# EAGLE board Power (EAGLE 8.5.2), part 1 of 2
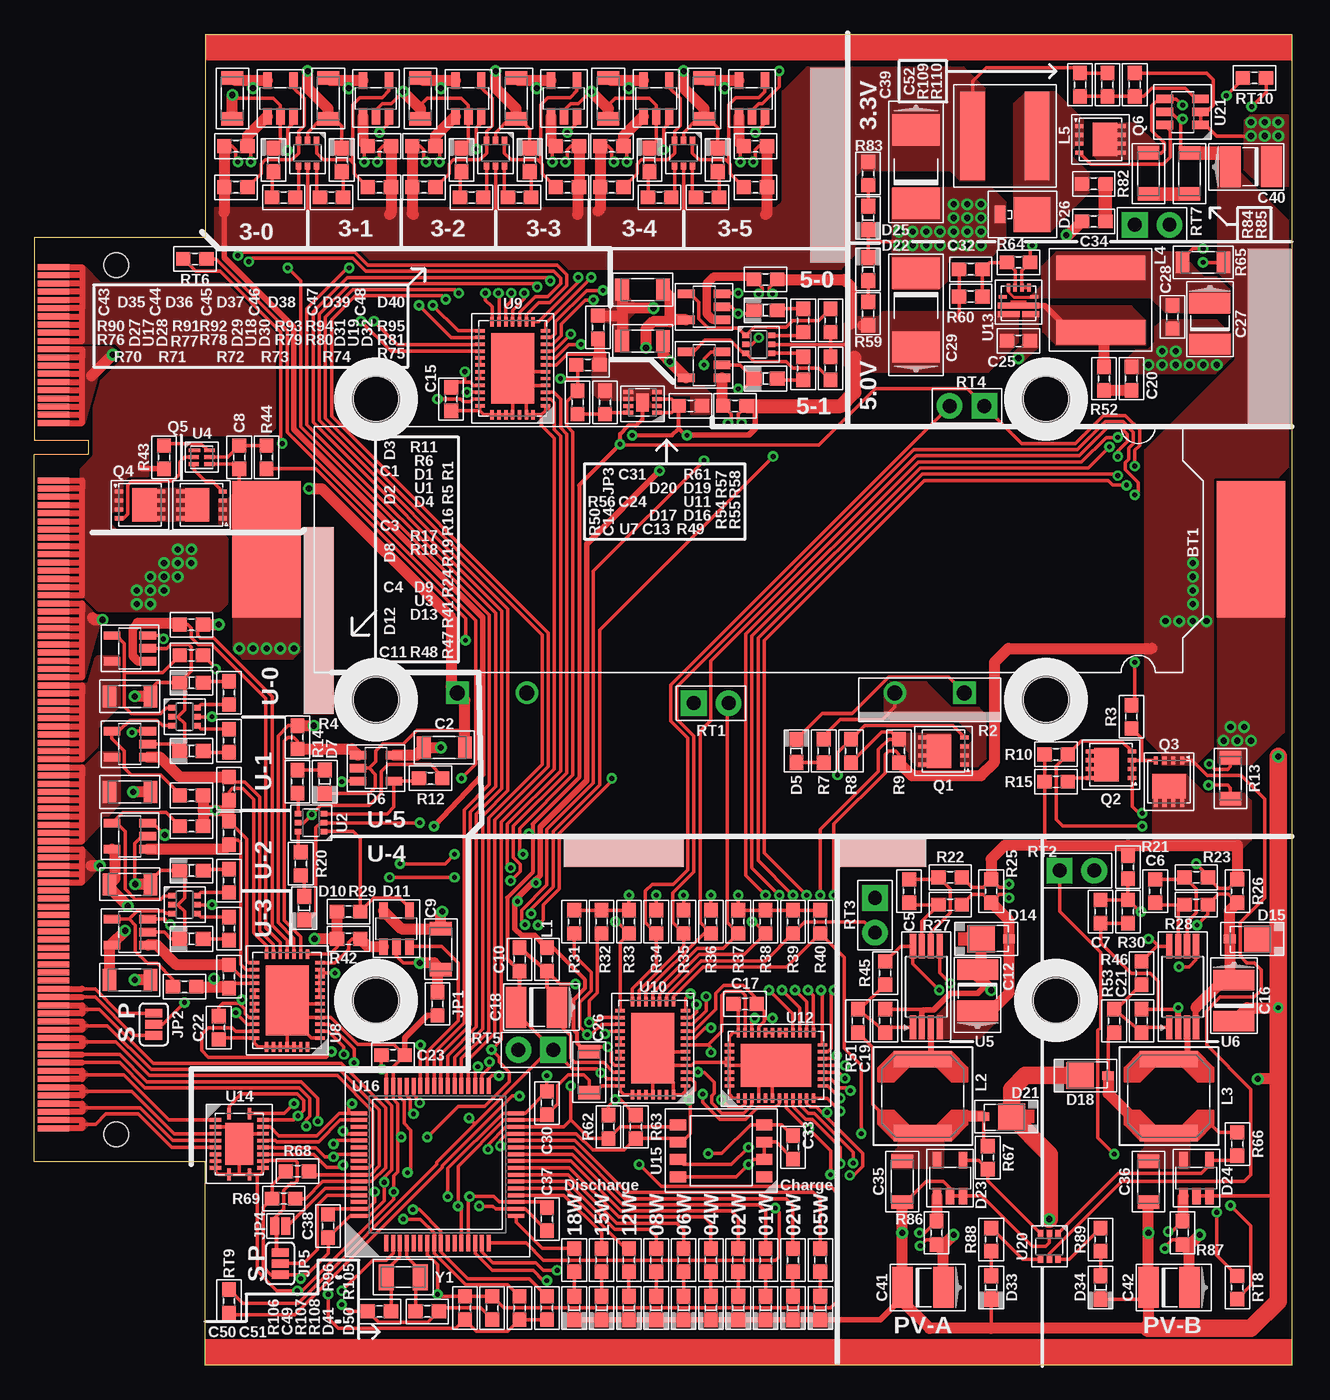
[diagram p4: board, top side]
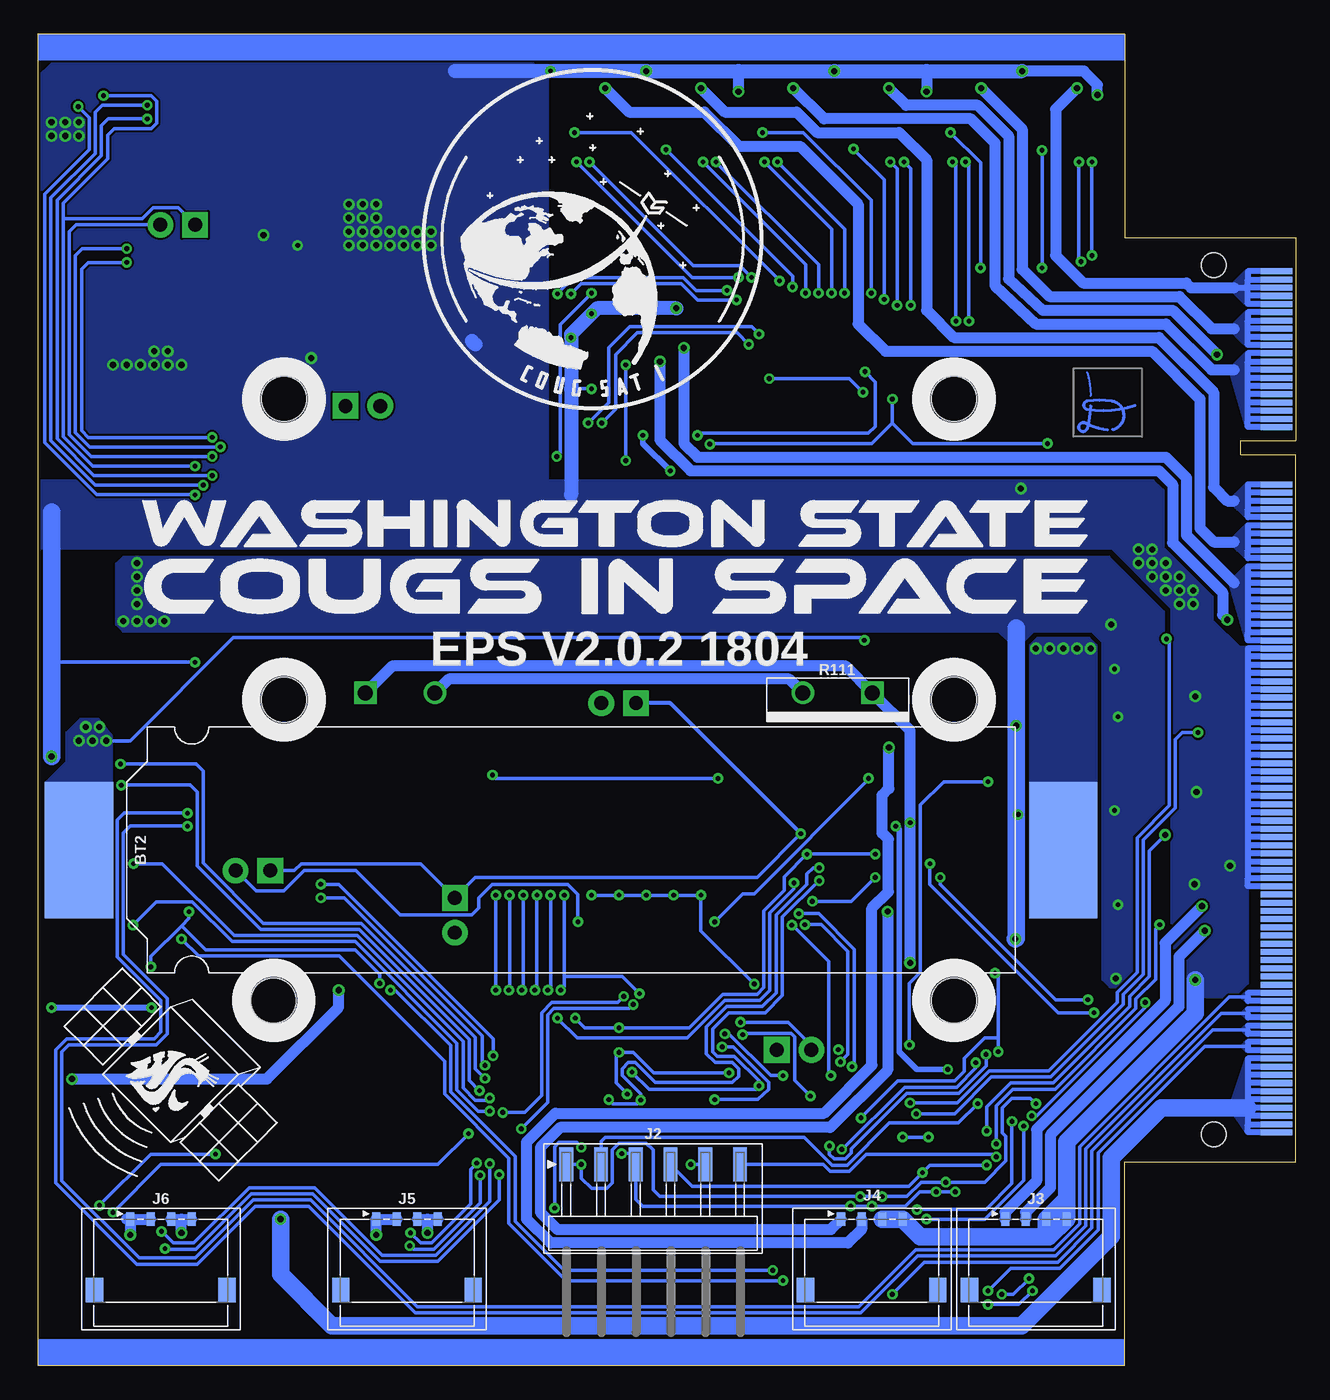
[diagram p5: board, bottom side, seen from below]

Size 92 x 97.4 mm. Coordinates in mm from the lower left corner, seen from the top.
Copper layers (1*16): Top 0.035mm / dielectric 0.9mm / Bottom 0.035mm
Design rules "JLCPCB *": minimum track width 6mil, minimum drill 0.3mm, track to track 6mil, track to pad 6mil, pad to pad 6mil, via to via 6mil, smd to smd 6mil, copper to edge 8mil, drill to drill 6mil, minimum pad ring 10mil, minimum via ring 8mil, stop-mask expansion 4mil, vias tented up to drill 20mil, thermal gap 10mil

## Footprints (pad centres in the part's own frame; a part is rotated, then mirrored left to right if it is on the bottom)
BAT-18650SOLDER = smd 5 x 10: A -36,0; C 36,0
3216 = smd 1 x 1.6: 1 -1.5,0; 2 1.5,0
1608 = smd 1.05 x 1: 1 -0.85,0; 2 0.85,0
4028-POL = smd 1.5 x 3: A 1.5,0; C -1.5,0
7132-POL = smd 2.3 x 3.5: A 2.7,0; C -2.7,0
1608-POL = smd 1.1 x 1: A 0.85,0; C -0.85,0
SOT23-5 = smd 0.62 x 1.22: 1 0.95,1.31; 2 0,1.31; 3 -0.95,1.31; 4 -0.95,-1.31; 5 0.95,-1.31
STMITE = smd 0.85 x 0.65: A -2.055,0 | smd 2 x 1.95: C 0,0
POWERMITE1 = smd 0.76 x 1.27: A 2.349,0 | smd 2.67 x 2.54: C 0,0
HOLE-3.3MM_PLAIN = hole 3.3: 0,0
COUGSATBUS_MALE-SODIMM = smd 2.3 x 0.44: 1 1.4,31.65; 3 1.4,31.05; 5 1.4,30.45; 7 1.4,29.85; 9 1.4,29.25; 11 1.4,28.65; 13 1.4,28.05; 15 1.4,27.45; 17 1.4,26.85; 19 1.4,26.25; 21 1.4,25.65; 23 1.4,25.05; 25 1.4,24.45; 27 1.4,23.85; 29 1.4,23.25; 31 1.4,22.65; 33 1.4,22.05; 35 1.4,21.45; 37 1.4,20.85; 39 1.4,20.25; 41 1.4,16.05; 43 1.4,15.45; 45 1.4,14.85; 47 1.4,14.25; 49 1.4,13.65; 51 1.4,13.05; 53 1.4,12.45; 55 1.4,11.85; 57 1.4,11.25; 59 1.4,10.65; 61 1.4,10.05; 63 1.4,9.45; 65 1.4,8.85; 67 1.4,8.25; 69 1.4,7.65; 71 1.4,7.05; 73 1.4,6.45; 75 1.4,5.85; 77 1.4,5.25; 79 1.4,4.65; 81 1.4,4.05; 83 1.4,3.45; 85 1.4,2.85; 87 1.4,2.25; 89 1.4,1.65; 91 1.4,1.05; 93 1.4,0.45; 95 1.4,-0.15; 97 1.4,-0.75; 99 1.4,-1.35; 101 1.4,-1.95; 103 1.4,-2.55; 105 1.4,-3.15; 107 1.4,-3.75; 109 1.4,-4.35; 111 1.4,-4.95; 113 1.4,-5.55; 115 1.4,-6.15; 117 1.4,-6.75; 119 1.4,-7.35; 121 1.4,-7.95; 123 1.4,-8.55; 125 1.4,-9.15; 127 1.4,-9.75; 129 1.4,-10.35; 131 1.4,-10.95; 133 1.4,-11.55; 135 1.4,-12.15; 137 1.4,-12.75; 139 1.4,-13.35; 141 1.4,-13.95; 143 1.4,-14.55; 145 1.4,-15.15; 147 1.4,-15.75; 149 1.4,-16.35; 151 1.4,-16.95; 153 1.4,-17.55; 155 1.4,-18.15; 157 1.4,-18.75; 159 1.4,-19.35; 161 1.4,-19.95; 163 1.4,-20.55; 165 1.4,-21.15; 167 1.4,-21.75; 169 1.4,-22.35; 171 1.4,-22.95; 173 1.4,-23.55; 175 1.4,-24.15; 177 1.4,-24.75; 179 1.4,-25.35; 181 1.4,-25.95; 183 1.4,-26.55; 185 1.4,-27.15; 187 1.4,-27.75; 189 1.4,-28.35; 191 1.4,-28.95; 193 1.4,-29.55; 195 1.4,-30.15; 197 1.4,-30.75; 199 1.4,-31.35 | smd 2.3 x 0.44 bottom: 2 1.4,31.35; 4 1.4,30.75; 6 1.4,30.15; 8 1.4,29.55; 10 1.4,28.95; 12 1.4,28.35; 14 1.4,27.75; 16 1.4,27.15; 18 1.4,26.55; 20 1.4,25.95; 22 1.4,25.35; 24 1.4,24.75; 26 1.4,24.15; 28 1.4,23.55; 30 1.4,22.95; 32 1.4,22.35; 34 1.4,21.75; 36 1.4,21.15; 38 1.4,20.55; 40 1.4,19.95; 42 1.4,15.75; 44 1.4,15.15; 46 1.4,14.55; 48 1.4,13.95; 50 1.4,13.35; 52 1.4,12.75; 54 1.4,12.15; 56 1.4,11.55; 58 1.4,10.95; 60 1.4,10.35; 62 1.4,9.75; 64 1.4,9.15; 66 1.4,8.55; 68 1.4,7.95; 70 1.4,7.35; 72 1.4,6.75; 74 1.4,6.15; 76 1.4,5.55; 78 1.4,4.95; 80 1.4,4.35; 82 1.4,3.75; 84 1.4,3.15; 86 1.4,2.55; 88 1.4,1.95; 90 1.4,1.35; 92 1.4,0.75; 94 1.4,0.15; 96 1.4,-0.45; 98 1.4,-1.05; 100 1.4,-1.65; 102 1.4,-2.25; 104 1.4,-2.85; 106 1.4,-3.45; 108 1.4,-4.05; 110 1.4,-4.65; 112 1.4,-5.25; 114 1.4,-5.85; 116 1.4,-6.45; 118 1.4,-7.05; 120 1.4,-7.65; 122 1.4,-8.25; 124 1.4,-8.85; 126 1.4,-9.45; 128 1.4,-10.05; 130 1.4,-10.65; 132 1.4,-11.25; 134 1.4,-11.85; 136 1.4,-12.45; 138 1.4,-13.05; 140 1.4,-13.65; 142 1.4,-14.25; 144 1.4,-14.85; 146 1.4,-15.45; 148 1.4,-16.05; 150 1.4,-16.65; 152 1.4,-17.25; 154 1.4,-17.85; 156 1.4,-18.45; 158 1.4,-19.05; 160 1.4,-19.65; 162 1.4,-20.25; 164 1.4,-20.85; 166 1.4,-21.45; 168 1.4,-22.05; 170 1.4,-22.65; 172 1.4,-23.25; 174 1.4,-23.85; 176 1.4,-24.45; 178 1.4,-25.05; 180 1.4,-25.65; 182 1.4,-26.25; 184 1.4,-26.85; 186 1.4,-27.45; 188 1.4,-28.05; 190 1.4,-28.65; 192 1.4,-29.25; 194 1.4,-29.85; 196 1.4,-30.45; 198 1.4,-31.05; 200 1.4,-31.65 | hole 1.8: 6,31.8; 6,-31.8
1X06_SMD-2.54MM-R = smd 1 x 2.5: 1 -6.35,0; 2 -3.81,0; 3 -1.27,0; 4 1.27,0; 5 3.81,0; 6 6.35,0
1X04_PICOLOCK1.5MM = smd 0.6 x 1: 1 2.25,0; 2 0.75,0; 3 -0.75,0; 4 -2.25,0 | smd 1.25 x 1.8: PAD@1 4.855,5.2; PAD@2 -4.833,5.2
SMT-JUMPER_3_NO_SILK = smd 0.635 x 1.27: 1 -0.813,0; 2 0,0; 3 0.813,0
SMT-JUMPER_2_NC_PASTE_SILK = smd 0.635 x 1.27: 1 -0.406,0; 2 0.406,0
INDUCTOR-LPS6235 = smd 1.2 x 4.25: 1 -2.7,0; 2 2.7,0
INDUCTOR-XAL7030 = smd 1.78 x 6.5: 2 2.36,0; 11 -2.36,0
SON-3.3X3.3MM = smd 0.6 x 0.3: 1 -1.55,0.975; 2 -1.55,0.325; 3 -1.55,-0.325; 4 -1.55,-0.975; 5 1.55,-0.975; 6 1.55,-0.325; 7 1.55,0.325; 8 1.55,0.975 | smd 1.775 x 2.45: PAD 0.325,0
TO220-2 = drill 1.1 square: 1 -2.54,0 | drill 1.1: 3 2.54,0
1X02_THERMISTOR = drill 1.016 pad 1.88 square: 1 0,0 | drill 1.016 pad 1.88: 2 2.54,0
SC70 = smd 0.4 x 0.5: 1 -0.65,-0.95; 2 0,-0.95; 3 0.65,-0.95; 4 0.65,0.95; 5 0,0.95; 6 -0.65,0.95
SON6-1.5X1.5MM = smd 0.28 x 0.85: 1 -0.5,-0.525 | smd 0.28 x 0.75: 2 0,-0.575; 3 0.5,-0.575; 4 0.5,0.575; 5 0,0.575; 6 -0.5,0.575
TSSOP8 = smd 0.45 x 1.78: 1 -0.975,-2.97; 2 -0.325,-2.97; 3 0.325,-2.97; 4 0.975,-2.97; 5 0.975,2.97; 6 0.325,2.97; 7 -0.325,2.97; 8 -0.975,2.97
WDFN8-2X2 = smd 0.7 x 0.29: 1 -1.05,0.75; 2 -1.05,0.25; 3 -1.05,-0.25; 4 -1.05,-0.75; 5 1.05,-0.75; 6 1.05,-0.25; 7 1.05,0.25; 8 1.05,0.75 | smd 0.9 x 1.3: PAD 0,0
QFN38-5X7 = smd 0.25 x 0.7: 1 -2.75,-2.4; 2 -2.25,-2.4; 3 -1.75,-2.4; 4 -1.25,-2.4; 5 -0.75,-2.4; 6 -0.25,-2.4; 7 0.25,-2.4; 8 0.75,-2.4; 9 1.25,-2.4; 10 1.75,-2.4; 11 2.25,-2.4; 12 2.75,-2.4; 20 2.75,2.4; 21 2.25,2.4; 22 1.75,2.4; 23 1.25,2.4; 24 0.75,2.4; 25 0.25,2.4; 26 -0.25,2.4; 27 -0.75,2.4; 28 -1.25,2.4; 29 -1.75,2.4; 30 -2.25,2.4; 31 -2.75,2.4 | smd 0.7 x 0.25: 13 3.4,-1.5; 14 3.4,-1; 15 3.4,-0.5; 16 3.4,0; 17 3.4,0.5; 18 3.4,1; 19 3.4,1.5; 32 -3.4,1.5; 33 -3.4,1; 34 -3.4,0.5; 35 -3.4,0; 36 -3.4,-0.5; 37 -3.4,-1; 38 -3.4,-1.5 | smd 5.15 x 3.15: PAD 0,0
QFN-TPS61236P = smd 1.25 x 0.44: 1 -0.9,0.77 | smd 3.05 x 0.45: 2 0,0.17 | smd 0.6 x 0.25: 3 -1.15,-0.475; 8 1.15,-0.475 | smd 0.25 x 0.6: 4 -0.75,-1.15; 5 -0.25,-1.15; 6 0.25,-1.15; 7 0.75,-1.15 | smd 1.6 x 0.44: 9 0.725,0.77
QFN20-3.5X4.5 = smd 0.85 x 0.28: 1 -2.225,-0.75; 10 2.225,-0.75; 11 2.225,0.75; 20 -2.225,0.75 | smd 0.28 x 0.85: 2 -1.75,-1.725; 3 -1.25,-1.725; 4 -0.75,-1.725; 5 -0.25,-1.725; 6 0.25,-1.725; 7 0.75,-1.725; 8 1.25,-1.725; 9 1.75,-1.725; 12 1.75,1.725; 13 1.25,1.725; 14 0.75,1.725; 15 0.25,1.725; 16 -0.25,1.725; 17 -0.75,1.725; 18 -1.25,1.725; 19 -1.75,1.725 | smd 3.05 x 2.05: PAD 0,0
SO8 = smd 1.2 x 0.8: 1 -3.15,1.905; 2 -3.15,0.635; 3 -3.15,-0.635; 4 -3.15,-1.905; 5 3.15,-1.905; 6 3.15,-0.635; 7 3.15,0.635; 8 3.15,1.905
QFP64-10X10 = smd 0.3 x 1.2: 1 -3.75,-5.75; 2 -3.25,-5.75; 3 -2.75,-5.75; 4 -2.25,-5.75; 5 -1.75,-5.75; 6 -1.25,-5.75; 7 -0.75,-5.75; 8 -0.25,-5.75; 9 0.25,-5.75; 10 0.75,-5.75; 11 1.25,-5.75; 12 1.75,-5.75; 13 2.25,-5.75; 14 2.75,-5.75; 15 3.25,-5.75; 16 3.75,-5.75; 33 3.75,5.75; 34 3.25,5.75; 35 2.75,5.75; 36 2.25,5.75; 37 1.75,5.75; 38 1.25,5.75; 39 0.75,5.75; 40 0.25,5.75; 41 -0.25,5.75; 42 -0.75,5.75; 43 -1.25,5.75; 44 -1.75,5.75; 45 -2.25,5.75; 46 -2.75,5.75; 47 -3.25,5.75; 48 -3.75,5.75 | smd 1.2 x 0.3: 17 5.75,-3.75; 18 5.75,-3.25; 19 5.75,-2.75; 20 5.75,-2.25; 21 5.75,-1.75; 22 5.75,-1.25; 23 5.75,-0.75; 24 5.75,-0.25; 25 5.75,0.25; 26 5.75,0.75; 27 5.75,1.25; 28 5.75,1.75; 29 5.75,2.25; 30 5.75,2.75; 31 5.75,3.25; 32 5.75,3.75; 49 -5.75,3.75; 50 -5.75,3.25; 51 -5.75,2.75; 52 -5.75,2.25; 53 -5.75,1.75; 54 -5.75,1.25; 55 -5.75,0.75; 56 -5.75,0.25; 57 -5.75,-0.25; 58 -5.75,-0.75; 59 -5.75,-1.25; 60 -5.75,-1.75; 61 -5.75,-2.25; 62 -5.75,-2.75; 63 -5.75,-3.25; 64 -5.75,-3.75
SOT23-6 = smd 0.62 x 1.22: 1 0.95,1.31; 2 0,1.31; 3 -0.95,1.31; 4 -0.95,-1.31; 5 0,-1.31; 6 0.95,-1.31
CRYSTAL-3.2X1.5 = smd 1.1 x 1.9: 1 -1.25,0; 2 1.25,0

## Placement (x,y rotation side)
BT1  18650  [BAT-18650SOLDER]  53,59.7 0 top
BT2  18650  [BAT-18650SOLDER]  53,37.7 180 bottom
C1  4.7µF  [3216]  7,48.95 0 top
C2  4.7µF  [3216]  30,45.2 0 top
C3  4.7µF  [3216]  7,41.95 0 top
C4  4.7µF  [3216]  7,35.2 0 top
C5  1µF  [1608]  64,34.7 90 top
C6  1µF  [1608]  82,34.7 90 top
C7  1nF  [1608]  78,33.2 270 top
C8  100nF  [1608]  15,66.45 270 top
C9  4.7µF  [3216]  29.75,30.45 270 top
C10  100nF  [1608]  35.5,29.7 270 top
C11  4.7µF  [3216]  7,28.2 0 top
C12  10µF  [4028-POL]  69,27.45 270 top
C13  100nF  [1608]  48,70.2 0 top
C14  270pF  [1608]  41.75,70.45 90 top
C15  100nF  [1608]  30.5,70.7 270 top
C16  10µF  [4028-POL]  87.75,26.7 90 top
C17  100nF  [1608]  52,26.45 180 top
C18  4.7µF  [4028-POL]  36.75,26.2 0 top
C19  100nF  [1608]  62.25,25.2 90 top
C20  470pF  [1608]  80.25,72.2 90 top
C21  100nF  [1608]  81,25.2 90 top
C22  100nF  [1608]  13.5,24.7 270 top
C23  100nF  [1608]  26.25,22.7 0 top
C24  4.7µF  [3216]  44.5,74.95 180 top
C25  1µF  [1608]  72,74.95 0 top
C26  100nF  [3216]  40.6,21.45 270 top
C27  10µF  [4028-POL]  86,76.2 90 top
C28  1µF  [1608]  83.25,76.7 270 top
C29  220µF  [7132-POL]  64.5,77.2 270 top
C30  100nF  [1608]  37.5,19.2 270 top
C31  4.7µF  [3216]  44.5,78.7 180 top
C32  10pF  [1608]  68.5,80.2 0 top
C33  100nF  [1608]  55.5,15.95 270 top
C34  470pF  [1608]  77.5,83.7 180 top
C35  4.7µF  [3216]  63.5,13.45 270 top
C36  4.7µF  [3216]  81.5,13.45 270 top
C37  100nF  [1608]  37.5,10.7 270 top
C38  100nF  [1608]  21.5,10.2 90 top
C39  220µF  [7132-POL]  64.5,87.7 90 top
C40  10µF  [4028-POL]  89,87.7 180 top
C41  47µF  [4028-POL]  65,5.7 0 top
C42  47µF  [4028-POL]  83,5.7 0 top
C43  4.7µF  [3216]  14.5,92.7 270 top
C44  4.7µF  [3216]  21.5,92.7 270 top
C45  4.7µF  [3216]  28.25,92.7 270 top
C46  4.7µF  [3216]  35.25,92.7 270 top
C47  4.7µF  [3216]  42,92.7 270 top
C48  4.7µF  [3216]  49,92.7 270 top
C49  10nF  [1608]  33.5,4.2 270 top
C50  15pF  [1608]  25.25,3.95 180 top
C51  15pF  [1608]  28.75,3.95 0 top
C52  4.7pF  [1608]  76.5,93.7 270 top
D1  GRN  [1608-POL]  11.5,49.95 0 top
D2  LTC4411  [SOT23-5]  7,45.45 270 top
D3  LTC4411  [SOT23-5]  7,52.45 270 top
D4  GRN  [1608-POL]  11.5,44.95 0 top
D5  GRN  [1608-POL]  55.75,44.95 270 top
D6  LTC4411  [SOT23-5]  25,43.7 90 top
D7  GRN  [1608-POL]  21.25,42.7 90 top
D8  LTC4411  [SOT23-5]  7,38.7 270 top
D9  GRN  [1608-POL]  11.5,36.2 0 top
D10  GRN  [1608-POL]  19.75,33.45 90 top
D11  LTC4411  [SOT23-5]  26.5,31.95 180 top
D12  LTC4411  [SOT23-5]  7,31.7 270 top
D13  GRN  [1608-POL]  11.5,31.2 0 top
D14  SMM4F5.0A  [STMITE]  69.25,31.2 180 top
D15  SMM4F5.0A  [STMITE]  89.5,31.2 0 top
D16  GRN  [1608-POL]  53.5,72.2 0 top
D17  LTC4411  [SOT23-5]  49,73.2 270 top
D18  SMM4F5.0A  [STMITE]  76.5,21.2 180 top
D19  GRN  [1608-POL]  53.5,77.2 0 top
D20  LTC4411  [SOT23-5]  49,77.45 270 top
D21  SMM4F5.0A  [STMITE]  71.5,18.2 0 top
D22  GRN  [1608-POL]  61,80.2 270 top
D23  LTC4411  [SOT23-5]  67,13.7 180 top
D24  LTC4411  [SOT23-5]  85,13.7 180 top
D25  GRN  [1608-POL]  61,83.95 90 top
D26  MBRM120LT3  [POWERMITE1]  73,84.2 180 top
D27  GRN  [1608-POL]  17.5,88.2 270 top
D28  GRN  [1608-POL]  22.5,88.2 270 top
D29  GRN  [1608-POL]  31.25,88.2 270 top
D30  GRN  [1608-POL]  36.25,88.2 270 top
D31  GRN  [1608-POL]  45,88.2 270 top
D32  GRN  [1608-POL]  50,88.2 270 top
D33  GRN  [1608-POL]  70,5.7 90 top
D34  GRN  [1608-POL]  78,5.7 90 top
D35  LTC4411  [SOT23-5]  18,92.7 180 top
D36  LTC4411  [SOT23-5]  25,92.7 180 top
D37  LTC4411  [SOT23-5]  31.75,92.7 180 top
D38  LTC4411  [SOT23-5]  38.75,92.7 180 top
D39  LTC4411  [SOT23-5]  45.5,92.7 180 top
D40  LTC4411  [SOT23-5]  52.5,92.7 180 top
D41  RED  [1608-POL]  39.5,4.2 90 top
D42  YLW  [1608-POL]  41.5,4.2 90 top
D43  YLW  [1608-POL]  43.5,4.2 90 top
D44  GRN  [1608-POL]  45.5,4.2 90 top
D45  GRN  [1608-POL]  47.5,4.2 90 top
D46  GRN  [1608-POL]  49.5,4.2 90 top
D47  GRN  [1608-POL]  51.5,4.2 90 top
D48  GRN  [1608-POL]  53.5,4.2 90 top
D49  BLU  [1608-POL]  55.5,4.2 90 top
D50  BLU  [1608-POL]  57.5,4.2 90 top
H1  MOUNTING_HOLE_PLAIN3MMBOLT  [HOLE-3.3MM_PLAIN]  25,48.7 0 top
H2  MOUNTING_HOLE_PLAIN3MMBOLT  [HOLE-3.3MM_PLAIN]  74,48.7 0 top
H3  MOUNTING_HOLE_PLAIN3MMBOLT  [HOLE-3.3MM_PLAIN]  25,70.7 0 top
H4  MOUNTING_HOLE_PLAIN3MMBOLT  [HOLE-3.3MM_PLAIN]  25,26.7 0 top
H5  MOUNTING_HOLE_PLAIN3MMBOLT  [HOLE-3.3MM_PLAIN]  74,70.7 0 top
H6  MOUNTING_HOLE_PLAIN3MMBOLT  [HOLE-3.3MM_PLAIN]  74.75,26.7 0 top
IMG1  COUGSINSPACELOGOTEXT  [COUGSINSPACETEXT]  49.5,59.45 0 bottom
IMG2  Bradley Davis  [SIGNATURE-BRADLEY]  16.25,67.95 0 bottom
IMG3  COUGSINSPACELOGOSMALL  [COUGSINSPACELOGO_SMALL]  82.29,21.28 0 bottom
IMG4  COUGSINSPACELOGOMEDIUM  [COUGSINSPACELOGO_MEDIUM]  51.43,82.4 0 bottom
J1  COUGSATBUSCARD  [COUGSATBUS_MALE-SODIMM]  0,48.7 0 top
J2  SWD  [1X06_SMD-2.54MM-R]  47,14.7 0 bottom
J3  UNREG  [1X04_PICOLOCK1.5MM]  19,10.7 180 bottom
J4  UNREG  [1X04_PICOLOCK1.5MM]  31,10.7 180 bottom
J5  PV1  [1X04_PICOLOCK1.5MM]  65,10.7 180 bottom
J6  PV1  [1X04_PICOLOCK1.5MM]  83,10.7 180 bottom
JP1  [1608]  29.5,26.45 90 top
JP2  SelectPrimary  [SMT-JUMPER_3_NO_SILK]  8.75,24.95 270 top
JP3  [1608]  41.25,75.95 270 top
JP4  NC  [SMT-JUMPER_2_NC_PASTE_SILK]  18,10.2 0 top
JP5  SelectPrimary  [SMT-JUMPER_3_NO_SILK]  18,7.45 90 top
L1  BLM18HE152SN1  [1608]  37.5,29.7 90 top
L2  10µH  [INDUCTOR-LPS6235]  65,19.7 270 top
L3  10µH  [INDUCTOR-LPS6235]  83,19.7 270 top
L4  1µH  [INDUCTOR-XAL7030]  78,77.95 270 top
L5  4.7µH  [INDUCTOR-XAL7030]  71,89.95 180 top
Q1  CSD25402Q3A  [SON-3.3X3.3MM]  66.5,44.95 180 top
Q2  CSD25402Q3A  [SON-3.3X3.3MM]  78.75,43.95 180 top
Q3  CSD25402Q3A  [SON-3.3X3.3MM]  83,42.7 270 top
Q4  CSD16406Q3  [SON-3.3X3.3MM]  7.75,62.95 0 top
Q5  CSD16406Q3  [SON-3.3X3.3MM]  12.25,62.95 180 top
Q6  CSD25402Q3A  [SON-3.3X3.3MM]  78,89.7 0 top
R1  560Ω  [1608]  14.25,49.2 90 top
R2  15Ω 30W  [TO220-2]  65.5,49.2 180 top
R3  100kΩ  [1608]  80.25,47.45 270 top
R4  50mΩ  [1608]  19.25,45.95 270 top
R5  560Ω  [1608]  14.25,45.7 270 top
R6  100kΩ  [1608]  11.5,51.95 180 top
R7  560Ω  [1608]  57.75,44.95 90 top
R8  10kΩ  [1608]  59.75,44.95 270 top
R9  50mΩ  [1608]  63.25,44.95 90 top
R10  10kΩ  [1608]  74.75,44.7 180 top
R11  50mΩ  [1608]  11.5,54.2 180 top
R12  100kΩ  [1608]  29,42.95 180 top
R13  10mΩ  [3216]  87.5,42.95 90 top
R14  560Ω  [1608]  19.25,42.7 90 top
R15  10kΩ  [1608]  74.75,42.7 180 top
R16  50mΩ  [1608]  14.25,42.2 90 top
R17  100kΩ  [1608]  11.5,41.7 180 top
R18  100kΩ  [1608]  11.5,39.45 180 top
R19  50mΩ  [1608]  14.25,38.95 270 top
R20  560Ω  [1608]  19.5,36.7 270 top
R21  820kΩ  [1608]  80,36.45 90 top
R22  1kΩ  [1608]  67,35.7 0 top
R23  1kΩ  [1608]  85,35.7 0 top
R24  560Ω  [1608]  14.25,35.45 90 top
R25  100mΩ  [1608]  70,34.7 90 top
R26  100mΩ  [1608]  88,34.7 90 top
R27  1kΩ  [1608]  67,33.7 0 top
R28  1kΩ  [1608]  85,33.7 0 top
R29  100kΩ  [1608]  23,33.2 0 top
R30  360kΩ  [1608]  80,33.2 90 top
R31  220kΩ  [1608]  39.5,32.45 90 top
R32  10kΩ  [1608]  41.5,32.45 90 top
R33  220kΩ  [1608]  43.5,32.45 90 top
R34  10kΩ  [1608]  45.5,32.45 90 top
R35  220kΩ  [1608]  47.5,32.45 90 top
R36  10kΩ  [1608]  49.5,32.45 90 top
R37  10kΩ  [1608]  51.5,32.45 90 top
R38  10kΩ  [1608]  53.5,32.45 90 top
R39  10kΩ  [1608]  55.5,32.45 90 top
R40  220kΩ  [1608]  57.5,32.45 90 top
R41  560Ω  [1608]  14.25,31.95 270 top
R42  50mΩ  [1608]  23,31.2 0 top
R43  2.2kΩ  [1608]  9.5,66.45 90 top
R44  330Ω  [1608]  17,66.45 270 top
R45  10kΩ  [1608]  62.25,28.7 90 top
R46  10kΩ  [1608]  81,28.7 90 top
R47  50mΩ  [1608]  14.25,28.45 90 top
R48  100kΩ  [1608]  11,27.7 180 top
R49  50mΩ  [1608]  51.25,70.2 180 top
R50  47kΩ  [1608]  39.75,70.45 90 top
R51  1kΩ  [1608]  60.25,25.2 90 top
R52  150Ω  [1608]  78.25,72.2 270 top
R53  1kΩ  [1608]  79,25.2 90 top
R54  1kΩ  [1608]  56.25,72.95 270 top
R55  100kΩ  [1608]  58.25,72.95 270 top
R56  12.1kΩ  [1608]  40.5,73.2 180 top
R57  1kΩ  [1608]  56.25,76.45 90 top
R58  100kΩ  [1608]  58.25,76.45 90 top
R59  1kΩ  [1608]  61,76.95 90 top
R60  1MΩ  [1608]  68.5,78.2 0 top
R61  50mΩ  [1608]  53.5,79.45 180 top
R62  1kΩ  [1608]  42,17.45 270 top
R63  1kΩ  [1608]  44,17.45 270 top
R64  330kΩ  [1608]  72,80.7 0 top
R65  10mΩ  [3216]  85.5,80.7 180 top
R66  100kΩ  [1608]  88,16.2 270 top
R67  100kΩ  [1608]  69.75,15.2 270 top
R68  1kΩ  [1608]  19.25,14.2 0 top
R69  1kΩ  [1608]  18.25,12.2 0 top
R70  560Ω  [1608]  18.25,85.45 180 top
R71  560Ω  [1608]  21.75,85.45 0 top
R72  560Ω  [1608]  32,85.45 180 top
R73  560Ω  [1608]  35.5,85.45 0 top
R74  560Ω  [1608]  45.75,85.45 180 top
R75  560Ω  [1608]  49.25,85.45 0 top
R76  100kΩ  [1608]  14.75,86.2 0 top
R77  100kΩ  [1608]  25.25,86.2 180 top
R78  100kΩ  [1608]  28.5,86.2 0 top
R79  100kΩ  [1608]  39,86.2 180 top
R80  100kΩ  [1608]  42.25,86.2 0 top
R81  100kΩ  [1608]  52.75,86.2 180 top
R82  150Ω  [1608]  77.5,86.45 0 top
R83  560Ω  [1608]  61,87.2 270 top
R84  10mΩ  [3216]  81.5,87.2 90 top
R85  10mΩ  [3216]  84.5,87.2 270 top
R86  50mΩ  [1608]  66,9.7 90 top
R87  50mΩ  [1608]  84,9.7 90 top
R88  560Ω  [1608]  70,9.2 270 top
R89  560Ω  [1608]  78,9.2 270 top
R90  50mΩ  [1608]  14.75,89.2 0 top
R91  50mΩ  [1608]  25.25,89.2 180 top
R92  50mΩ  [1608]  28.5,89.2 0 top
R93  50mΩ  [1608]  39,89.2 180 top
R94  50mΩ  [1608]  42.25,89.2 0 top
R95  50mΩ  [1608]  52.75,89.2 180 top
R96  560Ω  [1608]  39.5,7.7 270 top
R97  560Ω  [1608]  41.5,7.7 270 top
R98  560Ω  [1608]  43.5,7.7 270 top
R99  560Ω  [1608]  45.5,7.7 270 top
R100  560Ω  [1608]  47.5,7.7 270 top
R101  560Ω  [1608]  49.5,7.7 270 top
R102  560Ω  [1608]  51.5,7.7 270 top
R103  560Ω  [1608]  53.5,7.7 270 top
R104  560Ω  [1608]  55.5,7.7 270 top
R105  560Ω  [1608]  57.5,7.7 270 top
R106  100kΩ  [1608]  31.5,4.2 270 top
R107  1kΩ  [1608]  35.5,4.2 90 top
R108  1kΩ  [1608]  37.5,4.2 90 top
R109  620kΩ  [1608]  78.5,93.7 270 top
R110  360kΩ  [1608]  80.5,93.7 90 top
R111  15Ω 30W  [TO220-2]  33.5,49.2 180 bottom
RT1  NTCLE203E3302SB0  [1X02_THERMISTOR]  48.25,48.45 0 top
RT2  NTCLE203E3302SB0  [1X02_THERMISTOR]  75,36.2 0 top
RT3  NTCLE203E3302SB0  [1X02_THERMISTOR]  61.5,34.2 270 top
RT4  NTCLE203E3302SB0  [1X02_THERMISTOR]  69.5,70.2 180 top
RT5  NTCLE203E3302SB0  [1X02_THERMISTOR]  37.96,23.08 180 top
RT6  NTCS0603E3683JHT  [1608]  11.75,80.95 0 top
RT7  NTCLE203E3302SB0  [1X02_THERMISTOR]  80.5,83.45 0 top
RT8  NTCS0603E3683JHT  [1608]  88,5.7 90 top
RT9  NTCS0603E3683JHT  [1608]  14.25,4.7 270 top
RT10  NTCS0603E3683JHT  [1608]  89.25,94.2 0 top
U1  NC7WZ16  [SC70]  11,47.45 270 top
U2  NC7WZ16  [SC70]  20.25,39.7 90 top
U3  NC7WZ16  [SC70]  11,33.7 270 top
U4  BQ29700  [SON6-1.5X1.5MM]  12.25,66.45 270 top
U5  SPV1040  [TSSOP8]  65.25,27.7 0 top
U6  SPV1040  [TSSOP8]  84,27.7 0 top
U7  MCP1501-10  [WDFN8-2X2]  44.5,70.45 180 top
U8  LTC2499  [QFN38-5X7]  18.5,26.7 90 top
U9  LTC2499  [QFN38-5X7]  35,72.95 90 top
U10  LTC2499  [QFN38-5X7]  45.25,23.2 90 top
U11  NC7WZ16  [SC70]  53,74.7 270 top
U12  LTC2499  [QFN38-5X7]  54.25,21.95 0 top
U13  TPS61236P  [QFN-TPS61236P]  72,77.7 180 top
U14  74244  [QFN20-3.5X4.5]  15,16.2 270 top
U15  M24M01-R  [SO8]  50.25,15.7 180 top
U16  STM32L476RG  [QFP64-10X10]  29.5,14.7 0 top
U17  NC7WZ16  [SC70]  20,88.7 180 top
U18  NC7WZ16  [SC70]  33.75,88.7 180 top
U19  NC7WZ16  [SC70]  47.5,88.7 180 top
U20  NC7WZ16  [SC70]  74.25,8.7 180 top
U21  TPS64200  [SOT23-6]  84,91.7 270 top
Y1  ECS-.327-12.5-34QCS-TR  [CRYSTAL-3.2X1.5]  27,6.45 180 top

## Tracks (layer width: path | path; a pad name or v marks a point on that pad's centre or on a via)
3.3V  (via drill 0.35)
  Top 0.254: R109.1 C52.1 76.1,94.95 69.64,94.95 68.64,93.95 L5.2 | 53.5,89.3 R95.1 53,89.2 52.75,88.95 52.75,88.2 v52.6,88.05 | U19.5 47.5,83.95 | 39.75,89.3 R93.1 39.25,89.2 39,88.95 39,88.2 v38.85,88.05 | R94.1 42,89.2 42.25,88.95 42.25,88.2 v42.4,88.05 | U18.5 33.75,83.95 | R92.1 28.25,89.2 28.5,88.95 28.5,88.2 v28.65,88.05 | U17.5 20,83.95 | R91.1 25.5,89.2 25.25,88.95 25.25,88.2 v25.1,88.05 | R90.1 14.5,89.2 14.75,88.95 14.75,88.2 v14.9,88.05 | v14.9,81.2 15.15,81.45 23.45,81.45 24.4,80.5 38.25,80.5 38.95,79.8 38.95,79 37.7,77.75 36.9,77.75 36,76.85 U9.14 | v24.85,76.4 26.55,74.7 U9.22 | v28.15,77.55 30.5,75.2 U9.21 | v33.95,78.45 34,78.4 U9.18 | v34.9,78.45 34.9,77.85 34.5,77.45 U9.17 | U9.12 37.4,76.25 v40.75,79.6 | C37.1 37.1,11.95 U16.19 34,11.95 33.6,12.35 v31.85,12.35 31.75,12.25 U16.13 | v19,19.15 18.27,18.43 U14.20 | R68.1 17.4,13.2 R69.1 16.75,11.55 16.75,7.2 17.31,6.64 JP5.1 19.5,6.64 | 19.5,6.64 19.94,6.64 21.5,8.2 C38.1 23.1,10.95 U16.64 24.5,10.95 25.6,12.05 v25.6,13.4 25.6,13.75 26.15,14.3 26.15,19 25.75,19.4 U16.48 25.75,21.35 v25.45,21.65 25.4,21.7 C23.1 | R108.1 R107.1 34.65,2.5 32.35,2.5 R106.2 30.85,2.7 22.25,2.7 21.5,3.45 v21.5,5.2 | 19.5,6.64 v19.5,6.35 | v30.25,12.35 30.25,14.4 34.3,18.45 U16.32 35.9,18.45 C30.1 v37.5,21.2 | U15.8 51.34,13.8 v52.25,14.7 52.62,15.07 U15.2 U15.3 54.27,16.34 C33.2 | v41.75,24.25 41.95,24.45 U10.23
  Top 0.406: 13.9,84.35 13.9,81.05 19,75.95 19,68.5 32.8,54.7 32.8,43.25 v29.25,39.45
  Top 0.813: R94.1 R80.1 41.4,84.6 41.25,84.45 | R95.1 R81.1 53.6,84.3 53.5,84.2 | R93.1 R79.1 39.75,86.1 39.75,84.2 | R92.1 R78.1 27.65,84.3 27.75,84.2 | R90.1 R76.1 13.9,84.35 | R91.1 R77.1 26.1,84.3 26,84.2
  Bottom 0.254: v38.85,88.05 33.95,83.15 v33.95,78.45 | v52.6,88.05 44.15,79.6 v40.75,79.6 | v24.85,76.4 24.85,87.8 v25.1,88.05 | v28.15,77.55 28.15,87.55 v28.65,88.05 | v34.9,78.45 34.9,80.55 v42.4,88.05 | v14.9,81.2 v14.9,88.05 | v19.5,6.35 20.65,5.2 v21.5,5.2 | J2.1 v52.25,14.7 52.25,13.7 51.5,12.95 50.4,12.95 50,13.35 50,15.75 49.5,16.25 47.5,16.25 47,15.75 47,12.85 46.5,12.35 v31.85,12.35 v30.25,12.35 28.45,12.35 27.4,13.4 v25.6,13.4 22.75,13.4 21.2,14.95 21.2,16.75 21.45,17 21.45,18.85 20.75,19.55 19.4,19.55 v19,19.15 | v37.5,21.2 38.4,21.2 41.45,24.25 v41.75,24.25
  Bottom 0.406: v25.45,21.65 27.7,21.65 29,22.95 29,39.2 v29.25,39.45
  pour Top (no thermals): 13.25,84.65 54.25,84.65 54.75,85.15 54.75,93.2 56.5,94.95 68,94.95 69.5,93.45 69.5,86.7 67.75,86.7 67,87.45 60.5,87.45 60,86.95 60,81.25 59,80.25 39.1,80.25 38.4,80.95 24.55,80.95 23.6,81.9 13.25,81.9
3.3V_FB
  Top 0.254: C52.2 R109.2 R110.1 81.15,92.85 81.75,93.45 84.2,93.45 85,92.65 U21.3
3.3V_ISENSE  (via drill 0.35)
  Top 0.254: R84.2 82.45,88.7 82.65,88.9 82.65,89.45 81.75,90.35 81.75,92.15 82.25,92.65 U21.4 83.55,92.65 v84,92.2 | v79.9,64.4 78.9,64.4 78.55,64.75 65.1,64.75 53.4,53.05 53.4,37.5 v56.5,34.4 | v56.6,27.45 57,27.05 U12.20
  Bottom 0.254: v84,92.2 87.3,92.2 87.8,91.7 87.8,88.65 91.05,85.45 91.05,67.65 87.8,64.4 v79.9,64.4 | v56.5,34.4 56.5,27.55 v56.6,27.45
  pour Top (no thermals): 77.5,90.85 80.55,90.85 82.2,89.2 82.2,88.3 77.75,88.3 77.5,88.55
3.3V_LSW
  pour Top (no thermals): 72.55,93.15 74.7,93.15 76.7,91.15 76.7,89.3 76.2,89.3 75.9,89 75.9,88.45 77.1,87.25 77.1,85.8 74.3,83 71.7,83 71.7,92.3
3.3V_RISENSE
  Top 1: R85.2 R84.1
3.3V_SNUBBER
  Top 1: R82.2 C34.1
3.3V_SW
  Top 0.254: U21.6 83.1,90.34 83.1,88.4 82.6,87.9 77.28,87.9 Q6.4
5.0V_FB
  Top 0.254: R60.2 C32.2 69.85,80.7 R64.1 71.75,80.1 U13.6
5.0V_SNUBBER
  Top 0.813: R52.2 C20.1
5.0V_SW
  Top 0.406: U13.2 73.92,77.53 75.86,75.59 L4.2
  Top 0.813: R52.1 78.25,75.34 L4.2
  pour Top (no thermals): 73.8,77.45 80.25,77.45 81.25,76.45 81.25,74.7 74.75,74.7 73.8,75.65
5.0V_VIN  (via drill 0.35)
  Top 0.203: U13.7 71.25,78.56 71.63,78.18 U13.3
  Top 0.254: v85.5,81.7 84.75,81.7 84,80.95 R65.2 | v78.65,67.2 77.1,65.65 64.8,65.65 52.5,53.35 52.5,36.4 v54.5,34.4 | v54.7,27.45 56,26.15 U12.22
  Bottom 0.254: v85.5,81.7 88.75,81.7 89.25,81.2 89.25,68.25 88.2,67.2 v78.65,67.2 | v54.5,34.4 54.5,27.65 v54.7,27.45
  pour Top (no thermals): 72.95,78.15 81.65,78.15 82.75,77.05 87.4,77.05 87.4,78.7 86.5,79.6 85.6,79.6 83.8,81.4 74.75,81.4 73.75,80.4 73.75,79.05 72.95,78.25
5V  (via drill 0.35)
  Top 0.254: C32.1 R60.1 67.65,76.85 67.5,76.7 | 58.25,74.7 U11.5 | R55.1 58.25,74.7 | 58.25,74.7 R58.1 | R49.1 51.5,69.6 51.5,69.2 v51.75,68.95 | R61.1 53.75,78.85 53.75,78.65 v54,78.4 | 58.25,74.7 59.5,74.7 | U7.1 46.65,69.7 C13.1 46.65,70.7 U7.3 | U9.28 32.15,71.7 31.9,71.95 31.5,71.95 | 31.5,71.95 30.9,71.95 C15.1 | 31.5,71.95 v31.5,72.7 | U9.11 37.8,75.2 38.1,75.5 38.1,76.35 40.4,78.65 v41.6,78.65 | v39.25,75.45 38,74.2 U9.9 | U8.28 15.7,25.45 15.45,25.7 15.45,26.05 15,26.5 | C22.1 13.5,26.2 13.8,26.5 15,26.5 | v15.2,26.75 15.2,26.7 15,26.5 | U12.28 53,24.75 53.4,25.15 53.4,25.4 | 53.4,25.4 53.4,25.9 C17.1 52.85,26.8 51.85,27.8 50.45,27.8 49.85,27.2 49.85,26.05 48.25,24.45 U10.9 | U10.28 42.45,21.95 42.2,22.2 42.2,22.95 v41.95,23.3 40.95,23.3 C26.1 | v26,35.7 v30.75,35.7 | 53.4,25.4 v54,25.4 | R62.1 42,18.95 v42.5,19.45 42.85,19.45 R63.1
  Top 0.305: v43.75,68.05 46.65,68.05 47.15,68.55 | 47.15,68.55 C13.1 | 47.15,68.55 47.65,68.05 v47.75,68.05 | L1.2 37.95,30.55 40.3,28.2 40.3,27.6 39.45,26.75 39.45,24.55 39.7,24.3 39.7,23.6 40.35,22.95 C26.1
  Top 0.406: 52.75,70.2 52.75,68.55 52.25,68.05 v47.75,68.05 | v45.75,65.45 40.4,60.1 40.4,42.8 37,39.4 37,35.85 36.7,35.55 | L1.2 36.6,31.45 35.65,31.45 35.15,31.95 35.15,34 | v35.35,33.95 35.3,34 35.15,34 | 36.7,35.55 v36.7,35.3 | 36.7,35.55 35.15,34
  Top 0.813: 60.6,76.1 R59.1 | R61.1 59.25,79.45 59.75,78.95 59.75,76.2
  Top 1.016: R49.1 52.75,70.2 59,70.2 60,71.2 60,73.7
  Bottom 0.254: v31.5,72.7 30.75,71.95 30.75,68.7 31.25,68.2 43.6,68.2 v43.75,68.05 | v54,78.4 52.8,79.6 44.8,79.6 43.85,78.65 v41.6,78.65 | v51.75,68.95 50.25,70.45 50.25,74.45 48.7,76 39.8,76 v39.25,75.45 | v15.2,26.75 17.55,26.75 26,35.2 v26,35.7 | v35.35,33.95 32.5,33.95 v30.75,35.7 | v42.5,19.45 39.35,19.45 38.55,20.2 38.55,20.7 41.15,23.3 v41.95,23.3 | v36.7,35.3 36.7,34.85 38.45,33.1 38.45,27.45 39.2,26.7 41.75,26.7 44.5,23.95 52.55,23.95 v54,25.4
  Bottom 0.406: v47.75,68.05 47.75,67.45 v45.75,65.45
  pour Top (no thermals): 71.95,77.05 71.95,74.85 71.35,74.25 69.8,72.7 62.25,72.7 59.75,72.7 59.25,73.2 59.25,75.7 59.25,76.2 59.75,76.7 60.5,76.7 61.75,76.7 62,76.95 62.1,77.05
ADCA_ADCINN
  Top 0.254: U12.27 U12.26
ADCA_ADCINP
  Top 0.254: U12.24 U12.25
ADCB_ADCINN
  Top 0.254: U9.27 U9.26
ADCB_ADCINP
  Top 0.254: U9.25 U9.24
ADCC_ADCINN
  Top 0.254: U8.27 U8.26
ADCC_ADCINP
  Top 0.254: U8.25 U8.24
ADCF_ADCINN
  Top 0.254: U10.27 U10.26
ADCF_ADCINP
  Top 0.254: U10.25 U10.24
AGND  (via drill 0.35)
  Top 0.254: U9.30 32.1,70.7 31.9,70.5 31.4,70.5 31.2,70.7 v29.5,70.7 | U9.7 38.2,73.2 39,74 41.3,74 41.35,73.95 | v87.2,92.9 88.4,94.1 RT10.1 | RT6.1 11.8,80.05 13.6,80.05 18.05,75.6 18.05,67.55 v18.15,67.45 | U8.11 20.9,28.7 | 20.9,28.7 U8.10 U8.9 U8.8 U8.7 | U8.30 14.75,24.45 14.5,24.7 12.75,24.7 12.25,24.2 12.25,23.05 12.75,22.55 21.35,22.55 v21.75,22.95 | v22,28.7 20.9,28.7 | v42.85,67.4 42.9,67.35 57.4,67.35 61.5,71.45 68.25,71.45 RT4.1 72.25,67.45 76.15,67.45 78.2,69.5 79.8,69.5 80.85,68.45 80.85,67.3 80.5,66.95 v80.5,65.8 | RT5.1 37.68,23.08 32.27,17.68 | 32.27,17.68 29.45,14.85 29.45,14.7 19.3,4.55 15.25,4.55 RT9.1 | v31.8,18.1 32.23,17.68 32.27,17.68 | C18.C 35.25,25.79 RT5.1 | U12.7 54.5,19.15 54.25,18.9 52.95,18.9 52.05,18 50.15,18 48.9,19.25 v48.9,19.85 | 49.3,23.45 U10.7 | U12.30 52,27.05 51.7,27.35 50.6,27.35 50.3,27.05 50.3,24.45 49.3,23.45 | v49.5,22.9 49.5,23.25 49.3,23.45 | U10.30 41.9,20.95 v41.45,21.4 41.15,21.7 39.34,21.7 RT5.1 | RT2.1 75,33.2 78,30.2 78,24.7 77.8,24.5 77.8,16.65 v79,15.45 | RT8.1 89,5.85 89,10.2 v87.5,11.7
  Top 0.305: U7.PAD 44.5,69.25 44,68.75 43.45,68.75 42.85,68.15 v42.85,67.4 39.85,64.4 39.85,43 36.45,39.6 36.45,38.95 | 36.45,38.95 36.45,36.05 34.6,34.2 34.6,29.75 C10.2 35.5,26.45 C18.C | v36.2,38.9 36.4,38.9 36.45,38.95
  Top 0.813: 41.35,73.95 41.35,75 JP3.2
  Top 1: 41.35,73.95 R56.1
  Bottom 0.254: v29.5,70.7 29.5,68.95 | 29.5,68.95 31,67.45 42.8,67.45 v42.85,67.4 | v87.2,92.9 83.7,92.9 83.3,92.5 83.3,90.9 83.7,90.5 86.4,90.5 86.9,90 86.9,88.3 90.15,85.05 90.15,83.9 | RT7.1 81.75,84.7 83.55,84.7 84.35,83.9 90.15,83.9 | 90.15,83.9 90.15,67.95 88,65.8 v80.5,65.8 | v21.75,22.95 21.75,23.95 | 21.75,23.95 21.75,28.45 v22,28.7 | v18.15,67.45 28,67.45 29.5,68.95 | 21.75,23.95 22.75,23.95 24.25,22.45 24.25,21.5 24.95,20.8 29.1,20.8 v31.8,18.1 | v48.9,19.85 49.7,20.65 49.7,22.7 v49.5,22.9 48.45,22.9 46.95,21.4 v41.45,21.4 | RT2.1 73.25,36.2 72.75,36.7 64,36.7 RT3.1 60,35.7 39.4,35.7 v36.2,38.9 | v79,15.45 83.75,15.45 v87.5,11.7
  Bottom 0.305: v36.2,38.9 45.75,48.45 RT1.1
  pour Top (no thermals): 40.85,73.6 40.85,71.15 41.35,70.65 44.2,70.65 44.7,70.15 45.7,70.15 46.55,71 48.05,71 48.05,69.65 49.4,69.65 49.4,71.15 49,71.55 47.1,71.55 45.05,73.6
AVREF  (via drill 0.35)
  Top 0.254: U10.29 42.35,21.45 41.65,22.15 39.55,22.15 39.25,22.45 39.25,24.1 38.25,25.1 C18.A | L1.1 38.45,27.9 v39.6,27.9 | R40.2 R39.2 R38.2 R37.2 v51.5,34.4 | v49.5,34.4 R36.2 | v47.5,34.4 R35.2 | v45.5,34.4 R34.2 | v43.5,34.4 R33.2 R32.2 R31.2
  Top 0.305: C10.1 L1.1 37.5,27.7 38.25,26.95 C18.A
  Bottom 0.254: v51.5,34.4 v49.5,34.4 v47.5,34.4 v45.5,34.4 v43.5,34.4 43.5,31.8 v39.6,27.9
BATTPROTECT_BAT
  Top 0.254: U4.5 14.15,66.45 C8.1 R44.1
BATTPROTECT_COUT
  Top 0.254: Q4.4 6.53,61.98 6.85,62.3 6.85,64.4 7.15,64.7 10.15,64.7 10.65,65.2 10.65,66.1 11,66.45 U4.2
BATTPROTECT_SW
  pour Top (no thermals): 7.25,61.8 7.25,64.1 12.75,64.1 12.75,61.8
BATTPROTECT_V-
  Top 0.254: R43.2 9.65,67.45 12.2,67.45 12.7,66.95 U4.6
BATTPROTECT_VSS  (via drill 0.45)
  Top 0.254: U4.4 14.65,65.95 C8.2 15,64.2
  other vias: 15,52.45 16,52.45 17,52.45 18,52.45 19,52.45
  pour Bottom (no thermals): 19.4,32.8 14.6,32.8 14.6,52.7 15.1,53.2 18.9,53.2 19.4,52.7
  pour Top (no thermals): 14.6,64.6 14.6,52.35 15.25,51.7 18.9,51.7 19.4,52.2 19.4,64.6
  pour Top (no thermals): 13.55,63.35 14.15,63.35 14.75,63.95 15.75,63.95 15.75,60.95 14.75,60.95 14.1,61.6 13.55,61.6
BATTPROTECTDOUT
  Top 0.254: Q5.4 13.03,64.7 12.5,64.7 11.68,65.53 U4.3
BUS_I2C0_IRQ
  Top 0.254: 3.5,23.7 3.55,23.65 5.95,23.65 8.4,21.2 22.15,21.2 24.75,18.6 24.75,14.7 24.5,14.45 U16.57
  Top 0.44: J1.177 3.5,23.95 3.5,23.7 3.5,23.35 J1.179
  pour Top (no thermals): 3.5,23.95 3.8,23.65 3.5,23.35
BUS_I2C0_SCL
  Top 0.254: 3.5,24.95 3.6,24.85 5.35,24.85 8.55,21.65 22.3,21.65 25.25,18.7 25.25,14.6 24.6,13.95 U16.58 20.35,13.95 R68.2
  Top 0.44: J1.173 3.5,25.15 3.5,24.95 3.5,24.55 J1.175
  pour Top (no thermals): 3.5,25.15 3.8,24.85 3.5,24.55
BUS_I2C0_SDA
  Top 0.254: 3.5,26.2 3.65,26.05 4.75,26.05 8.7,22.1 22.45,22.1 25.7,18.85 25.7,14.45 24.7,13.45 U16.59 21.1,13.45 19.85,12.2 R69.2
  Top 0.44: J1.169 3.5,26.35 3.5,26.2 3.5,25.75 J1.171
  pour Top (no thermals): 3.5,26.35 3.8,26.05 3.5,25.75
BUS_JTAG_TCK
  Top 0.254: 3.5,21.3 3.55,21.25 6.55,21.25 9.85,17.95 U14.2
  Top 0.44: J1.185 3.5,21.55 3.5,21.3 3.5,20.95 J1.187
  pour Top (no thermals): 3.5,21.55 3.8,21.25 3.5,20.95
BUS_JTAG_TDI
  Top 0.254: 3.5,20.2 3.65,20.05 7.15,20.05 10.25,16.95 U14.4
  Top 0.44: J1.189 3.5,20.35 3.5,20.2 3.5,19.75 J1.191
  pour Top (no thermals): 3.5,20.35 3.8,20.05 3.5,19.75
BUS_JTAG_TDO
  Top 0.254: 3.5,18.95 3.6,18.85 7.75,18.85 10.15,16.45 U14.5
  Top 0.44: J1.193 3.5,19.15 3.5,18.95 3.5,18.55 J1.195
  pour Top (no thermals): 3.5,19.15 3.8,18.85 3.5,18.55
BUS_JTAG_TMS
  Top 0.254: 3.5,17.65 4.5,17.65 5.25,18.4 7.6,18.4 10.05,15.95 U14.6
  Top 0.44: J1.197 3.5,17.95 3.5,17.65 3.5,17.35 J1.199
  pour Top (no thermals): 3.5,17.95 3.8,17.65 3.5,17.35
CTRL_!RESET  (via drill 0.35)
  Top 0.254: U16.7 28.75,8.1 29.5,7.35 v29.5,5.2 29.65,5.05 R106.1 C49.1 34.35,4.2 58.25,4.2 58.75,4.7 58.75,12.6 58.25,13.1 45.85,13.1 v44.25,14.7
  Bottom 0.254: 3.5,24.45 3.6,24.55 6.05,24.55 14.9,15.7 14.9,10.05 17.4,7.55 27.15,7.55 v29.5,5.2 | v44.25,14.7 J2.5
  Bottom 0.44: J1.176 3.5,24.25 3.5,24.45 | J1.174 3.5,24.85
  pour Bottom (no thermals): 3.5,24.85 3.8,24.55 3.5,24.25
CTRL_SYNC  (via drill 0.35)
  Top 0.254: v22.5,5.45 24.75,7.7 25.75,7.7 26.25,8.2 U16.2
  Bottom 0.254: 3.5,23.45 3.6,23.35 6.65,23.35 14.45,15.55 14.45,9.9 17.25,7.1 20.85,7.1 v22.5,5.45
  Bottom 0.44: J1.180 3.5,23.05 3.5,23.45 | J1.178 3.5,23.65
  pour Bottom (no thermals): 3.5,23.65 3.8,23.35 3.5,23.05
DGND  (via drill 0.35)
  Top 0.254: 37.1,69.55 U9.38 U9.37 36,70.45 35,71.45 | 37.1,69.55 37.4,69.85 U9.1 37.6,70 | 32.6,69.85 U9.31 | 32.6,69.85 32.9,69.55 U9.32 U9.33 U9.34 U9.35 35,71.45 | 35,71.45 35,71.7 | 35,71.7 U9.PAD 35.25,72.7 U9.6 | U9.4 35,71.7 | C15.2 32.6,69.85 | U8.35 U8.34 U8.33 U8.32 16.4,23.3 16.1,23.6 U8.31 13.6,23.95 C22.2 | U8.35 18.5,25.2 | 18.5,25.2 U8.PAD 19,26.2 | 19,26.2 19.5,25.7 19.5,25.45 U8.4 21.7,25.45 23.65,23.5 26.3,23.5 C23.2 26.25,21.85 U16.47 26.25,19.5 26.6,19.15 26.6,16.7 | U8.6 19.25,26.45 19,26.2 | C38.2 21.9,11.45 U16.63 24.4,11.45 24.9,11.95 v24.9,12.7 | C37.2 35.9,11.45 U16.18 33.75,11.45 33.55,11.65 v32.55,11.65 | U14.7 U14.8 U14.9 13.28,14.18 13.47,13.98 U14.10 15,13.98 | U14.17 15.25,16.95 | 15.25,16.95 U14.PAD 15,13.98 | U14.3 15.25,17.45 15.25,16.95 | 15,13.98 U14.11 16.25,13.98 | 16.25,13.98 16.52,13.98 16.73,14.18 U14.12 U14.13 16.77,15 19.1,15 19.25,14.85 19.25,13.5 19.05,13.3 18.75,13.3 18.25,12.8 18.25,11.45 17.59,10.79 JP4.1 | 16.25,13.98 16.3,13.93 16.3,6.9 17.75,5.45 v19.25,5.45 19.6,5.45 26.3,12.15 v26.3,12.7 26.3,13.85 26.6,14.15 26.6,16.7 | C49.2 32.65,4.2 29.85,4.2 C51.2 28.8,3.15 25.2,3.15 C50.2 23,3.95 v22.5,4.45 | U16.12 31.25,11.4 v31,11.65 31,14.55 34.4,17.95 U16.31 37.35,17.95 C30.2 38.3,19.15 38.3,20.5 39.05,21.25 40.2,21.25 40.6,20.85 C26.2 41,19.95 41.5,20.45 U10.31 42.85,20.1 43.15,19.8 U10.32 U10.33 U10.34 U10.35 45.25,21.95 | U8.37 U8.36 U8.35 | U8.1 20.25,23.95 19,25.2 18.5,25.2 | 37.1,69.55 37.1,68.8 38.05,67.85 38.05,43.65 34.15,39.75 34.15,23.8 v33.45,23.1 34,22.55 34,22.2 34.75,21.45 34.75,20.75 32.95,18.95 31,18.95 v28.75,16.7
  Top 0.254: 26.6,16.7 v26.85,16.7 | C33.1 54.7,17.61 U15.4 52.41,17.61 50.3,15.5 v49.3,15.5 | U12.6 54,21.7 U12.PAD | U12.4 53,21.95 U12.PAD | U12.PAD U12.35 | 50.85,22.2 U12.34 U12.33 U12.32 50.85,24.05 51.15,24.35 U12.31 51.5,26.1 C17.2 | 50.85,22.2 U12.35 | U12.35 U12.36 U12.37 U12.38 50.85,19.85 51.15,19.55 U12.1 | U10.1 47.65,20.1 47.35,19.8 U10.38 46.75,20.7 45.5,21.95 | 45.25,21.95 45.25,22.95 | 45.25,22.95 U10.PAD | U10.6 45.25,22.95 | 45.5,21.95 U10.4 48.1,21.95 48.3,22.15 50.8,22.15 50.85,22.2 | 45.5,21.95 45.25,21.95
  Top 0.305: JP5.3 17.75,8.51 17.75,10.04 JP4.1
  Top 0.406: JP1.1 28.75,25.6 27.1,23.95 C23.2
  Bottom 0.254: v19.25,5.45 20.25,4.45 v22.5,4.45 | v24.9,12.7 v26.3,12.7 27.5,12.7 28.55,11.65 v31,11.65 v32.55,11.65 47.77,11.65 48.27,12.15 J2.3 48.27,15 48.77,15.5 v49.3,15.5 | v26.85,16.7 v28.75,16.7
I2C_SCL  (via drill 0.35)
  Top 0.254: U9.2 37.8,70.7 38.05,70.45 38.05,68.45 38.5,68 38.5,43.5 34.6,39.6 34.6,36.65 v34.85,36.4 | U8.2 21.5,24.45 22.65,23.3 v22.65,22.75 | v34.1,16.05 34.1,16.45 34.6,16.95 U16.29 39.65,16.95 40.85,15.75 43.15,15.75 R63.2 46.84,16.6 U15.6 47.38,16.34 48,16.95 48,19.3 v47.9,19.4 47.9,19.75 48.3,20.15 48.3,20.7 48.05,20.95 U10.2 | U12.2 52,19.15 51.75,18.9 50.8,18.9 v50.25,19.45
  Bottom 0.254: v22.65,22.75 22.65,21.9 24.65,19.9 28.45,19.9 32.5,15.85 32.5,15.55 32.95,15.1 33.75,15.1 34.1,15.45 v34.1,16.05 | 47.95,19.45 v47.9,19.4 | v47.9,19.4 48.15,19.15 49.95,19.15 v50.25,19.45 | v47.9,19.4 47.9,19.85 49.25,21.2 49.25,21.7 48.8,22.15 48.3,22.15 46.85,20.7 41.2,20.7 40.75,21.15 40.75,21.7 41.2,22.15 42.45,22.15 43.1,22.8 43.1,24.75 41.6,26.25 39,26.25 38,27.25 38,32.95 35.75,35.2 35.75,35.95 35.3,36.4 v34.85,36.4
I2C_SDA  (via drill 0.35)
  Top 0.254: U9.3 38,71.2 38.5,70.7 38.5,68.6 38.95,68.15 38.95,43.35 35.05,39.45 35.05,37.15 35.55,36.65 35.55,36.15 v34.85,35.45 | U8.3 21.6,24.95 23.4,23.15 v23.4,22.15 | v33.2,15.8 33.2,16.15 34.5,17.45 U16.30 38.75,17.45 39.25,17.95 | U12.3 52.5,19.05 51.9,18.45 50.3,18.45 49.55,19.2 49.55,19.7 49.75,19.9 49.75,20.7 49,21.45 v48.55,21.45 U10.3 | v39.25,20.45 39.25,17.95 | 39.25,17.95 40.6,16.6 R62.2 42.85,17.45 46.95,17.45 U15.5
  Bottom 0.254: v33.2,15.8 33.15,15.8 28.6,20.35 24.8,20.35 23.4,21.75 v23.4,22.15 | 39.5,20.3 v39.25,20.45 | v34.85,35.45 34.9,35.45 37.55,32.8 37.55,27.05 38.8,25.8 41.45,25.8 42.65,24.6 42.65,22.95 42.3,22.6 41.05,22.6 39.25,20.8 v39.25,20.45 | v39.25,20.45 39.5,20.2 47.3,20.2 v48.55,21.45
I3.3V_0  (via drill 0.35)
  Top 0.254: R90.2 15.85,88.95 v15.85,88.05 | v15.7,80.75 15.95,81 23.3,81 24.25,80.05 38,80.05 38.5,79.55 38.5,79.15 37.55,78.2 36.65,78.2 35.5,77.05 U9.15
  Top 0.813: D35.1 15.6,89.94 R90.2
  Bottom 0.254: v15.7,80.75 15.85,80.9 v15.85,88.05
I3.3V_1  (via drill 0.35)
  Top 0.254: R91.2 24.15,88.95 v24.15,88.05 | v23.9,76.4 26.1,74.2 U9.23
  Top 0.813: D36.1 24.05,89.55 R91.2
  Bottom 0.254: v23.9,76.4 23.9,87.8 v24.15,88.05
I3.3V_2  (via drill 0.35)
  Top 0.254: R92.2 29.65,88.9 v29.65,88.05 | v29.15,77.55 31,75.7 U9.20
  Top 0.813: D37.1 29.35,89.94 R92.2
  Bottom 0.254: v29.15,77.55 29.15,87.55 v29.65,88.05
I3.3V_3  (via drill 0.35)
  Top 0.254: R93.2 37.9,88.95 v37.9,88.05 | v33,78.45 33,77.95 33.5,77.45 U9.19
  Top 0.813: D38.1 37.8,89.55 R93.2
  Bottom 0.254: v37.9,88.05 33,83.15 v33,78.45
I3.3V_4  (via drill 0.35)
  Top 0.254: R94.2 43.35,88.95 v43.35,88.05 | v35.85,78.45 35.85,78.05 35,77.2 U9.16
  Top 0.813: D39.1 43.1,89.94 R94.2
  Bottom 0.254: v35.85,78.45 35.85,80.55 v43.35,88.05
I3.3V_5  (via drill 0.35)
  Top 0.254: R95.2 51.65,88.95 v51.65,88.05 | U9.13 36.9,76.35 39.8,79.25 v39.8,79.6
  Top 0.813: D40.1 51.55,89.55 R95.2
  Bottom 0.254: v51.65,88.05 44.05,80.45 40.65,80.45 v39.8,79.6
I5.0V_0  (via drill 0.35)
  Top 0.254: R61.2 53.25,78.85 53.25,78.65 v53,78.4 | U9.10 37.9,74.7 38.55,75.35 38.55,76.2 40.3,77.95 v40.9,77.95
  Top 0.61: D20.1 49.65,76.5 49.2,76.95 49.2,79.15 49.7,79.65 52.45,79.65 R61.2
  Bottom 0.254: v53,78.4 52.25,79.15 44.95,79.15 43.75,77.95 v40.9,77.95
I5.0V_1  (via drill 0.35)
  Top 0.254: R49.2 51,69.6 51,69.2 v50.75,68.95 | v40,74.7 39.1,74.7 38.1,73.7 U9.8
  Top 0.813: R49.2 50.31,70.29 D17.1
  Bottom 0.254: v50.75,68.95 49.75,69.95 49.75,73.95 48.15,75.55 40.85,75.55 v40,74.7
IBATT-  (via drill 0.35, 0.45)
  Top 0.254: R13.2 87.5,43.8 87.3,43.6 86.35,43.6 v85.95,44 | v31.55,53.05 31.55,54.65 20.6,65.6 R44.2 | U12.15 58.85,21.45 v59.3,21
  Bottom 0.254: v31.55,53.05 31.75,53.25 77.7,53.25 85.25,45.7 v87,45.7 | v59.3,21 60,21.7 60,24 68.35,32.35 75.5,32.35 79.9,36.75 79.9,43.5 80.4,44 v85.95,44
  other vias: 88,45.7 87.5,46.7 88.5,46.7 89,45.7
  pour Top (no thermals): 86.6,64.6 91.4,64.6 91.4,46.35 89.05,44 86.7,44 86.6,44.1
  pour Bottom (no thermals): 91.4,32.8 91.4,42.7 89.9,44.2 89.9,46.3 88.9,47.3 87.6,47.3 86.6,46.05 86.6,32.8
IHEATER  (via drill 0.35)
  Top 0.254: R8.2 62,46.35 62.7,46.35 R9.2 62.5,45.8 61.75,45.05 61.75,43.45 57.5,39.2 v57.5,34.4 | v57.55,27.45 57.65,27.35 U12.19
  Bottom 0.254: v57.5,34.4 57.5,27.5 v57.55,27.45
  pour Top (no thermals): 62.85,45.4 62.85,46.2 67,46.2 67,43.75 64.7,43.75 64.05,44.4 64.05,44.8 63.45,45.4
IUNREG_0
  Top 0.254: R11.2 11.25,54.2 11.5,53.95 11.5,53.25 12,52.75 13,52.75 16.95,48.8 16.95,32 18,30.95 U8.17
  Top 0.61: D3.1 7.6,51.5 7.2,51.9 7.2,53.9 7.6,54.3
  Top 0.813: 7.6,54.3 10.55,54.3 R11.2
IUNREG_1
  Top 0.254: R16.2 14.6,42.7 15.4,42.7 16.5,41.6 16.5,31.8 17.5,30.8 U8.18
  Top 0.813: D2.1 9.2,44.5 10.65,43.05 R16.2
IUNREG_2
  Top 0.254: R19.2 14.6,38.45 14.9,38.45 15.1,38.25 15.1,29.35 15.5,28.95 U8.21
  Top 0.813: R19.2 13.9,37.75 D8.1
IUNREG_3
  Top 0.254: R47.2 15.1,28.45 U8.22
  Top 0.813: D12.1 8.95,30.75 10.4,29.3 R47.2
IUNREG_4
  Top 0.254: R42.2 23.25,31.2 23,30.95 23,30.45 22,29.45 U8.12
  Top 0.813: R42.2 24.41,30.64 D11.1
IUNREG_5
  Top 0.254: R4.2 19.25,45.7 19,45.95 18.55,45.95 18.3,45.7 18.3,32.55 19.5,31.35 U8.14
  Top 0.813: 19.35,45.2 R4.2 23.24,45.1 D6.1
JTAG_SEL_PMIC  (via drill 0.35)
  Top 0.254: JP2.2 9.4,24.95 v11,26.55 | U14.1 14.25,18.95 15.15,19.85 19.25,19.85 19.7,19.4 19.7,18.65 v19.3,18.25 19,17.95 U14.19
  Bottom 0.254: v11,26.55 11,26.2 18.95,18.25 v19.3,18.25
JTAG_SEL_PMIC0
  Top 0.254: 3.5,27.55 4.45,27.55 6.24,25.76 JP2.1
  Top 0.44: J1.165 3.5,27.55
JTAG_SEL_PMIC1
  Top 0.254: 3.5,26.95 4.45,26.95 7.26,24.14 JP2.3
  Top 0.44: J1.167 3.5,26.95
JTAG_TCK  (via drill 0.35)
  Top 0.254: 23,18.45 22.3,18.45 20.65,16.8 17.9,16.8 17.25,17.45 U14.18 | 23,18.45 U16.49 | 23,18.45 23,18.9 v23.25,19.15
  Bottom 0.254: v23.25,19.15 24.68,17.73 29.73,17.73 32.8,14.65 33.9,14.65 35.95,16.7 50.5,16.7 50.81,16.39 J2.2
JTAG_TDI
  Top 0.254: U16.50 22.4,17.95 20.8,16.35 17.75,16.35 17.65,16.45 U14.16
JTAG_TDO  (via drill 0.35)
  Top 0.254: U16.55 22.05,15.45 v21.9,15.25 21.25,15.25 20.6,15.9 17.6,15.9 17.55,15.95 U14.15
  Bottom 0.254: 40.75,13.7 40.65,13.8 J2.6 34.55,14.7 34.05,14.2 32.65,14.2 31.4,15.45 22.05,15.45 v21.9,15.25
JTAG_TMS  (via drill 0.35)
  Top 0.254: U14.14 20.45,15.45 21.4,14.5 22.45,14.5 v22.6,14.65 | U16.46 26.75,19.6 27.05,19.3 27.05,17.7 27.55,17.2 27.55,14.35 v27.3,14.1
  Bottom 0.254: J2.4 44.13,13.1 28.3,13.1 v27.3,14.1 26.75,14.65 v22.6,14.65
MEM_!WC  (via drill 0.35)
  Top 0.254: U16.16 36,8.95 37.25,7.7 54.25,7.7 54.5,7.95 54.5,11.2 v54.2,11.5 | U15.7 47.47,14.7 51,14.7 v52.25,15.95
  Bottom 0.254: v52.25,15.95 52.6,16.3 53.9,16.3 54.2,16 v54.2,11.5
MPPTA_VIN
  Top 0.254: L2.2 63.45,17 61.35,19.1 61.35,23.25 R51.1 | R67.1 69.44,16.36 D21.A
  Top 0.813: D21.A 67.65,18.2 66.45,17 L2.2
  pour Top (no thermals): 62.75,15.45 63.25,15.95 63.25,17.45 66.5,17.45 66.5,14.45 62.75,14.45
MPPTB_VIN
  Top 0.254: R66.1 86.65,17.05 86,17.7 85.3,17 L3.2 | D18.A 78.56,23.91 R53.1
  Top 0.813: D18.A 78.56,19.9 81.45,17 L3.2
  pour Top (no thermals): 80.75,15.45 81.25,15.95 81.25,17.45 84.5,17.45 84.5,14.45 80.75,14.45
OSC32_IN
  Top 0.254: U16.3 26.75,7.95 25.75,6.95 Y1.2 26.1,6.1 C50.1
OSC32_OUT
  Top 0.254: U16.4 27.25,7.95 28.25,6.95 Y1.1 27.9,6.1 C51.1
PGND  (via drill 0.35, 0.45)
  Top 0.254: D33.C 70,2.7 | D24.2 D24.3 90.94,12.39 91,12.45 | 81.75,11.95 C36.2 | D34.C 81.35,4.85 81.5,4.7 | C21.2 82.23,26.05 | 82.23,26.05 83.56,26.05 v83.67,26.16 | 82.23,26.05 82.23,28.1 81.65,28.69 80.23,28.69 78,30.91 C7.2 R30.1 | C19.2 64.85,26.05 64.85,25.95 64.92,25.88 | C35.2 63.75,11.95 65.25,13.45 66.5,13.45 67,12.95 D23.2 D23.3 69.31,12.39 73,8.7 74,8.7 74.25,8.95 U20.2 | R110.2 85.75,94.55 86.25,94.05 86.25,92.2 85.75,91.7 U21.2 U21.1 85.7,90.75 86.5,89.95 v89,89.95 | U19.2 47.5,90.2 48.5,91.2 C48.2 49.35,91.2 50,90.55 D32.C 50.05,89.05 | D31.C 45.5,89.55 D39.2 45.5,92.2 45,92.7 42.5,92.7 42,92.2 42,91.95 | 52.5,91.85 D40.2 52.5,91.8 53,92.3 53.25,92.3 54.5,93.55 v54.5,94.7 | U18.2 33.75,90.2 34.75,91.2 C46.2 35.5,91.2 36.25,90.45 D30.C | D38.2 38.75,91.8 39.25,92.3 39.8,92.3 40.7,93.2 v40.75,93.2 | D29.C 31.75,89.55 D37.2 31.75,92.2 31.25,92.7 28.75,92.7 28.25,92.2 28.25,91.95 | D36.2 25,91.85 25.45,92.3 26.1,92.3 v27,93.2 | D27.C 18,89.55 D35.2 18,92.2 17.5,92.7 14.75,92.7 v14.5,92.95 | U17.2 20,90.2 21,91.2 C44.2 21.95,91.2 22.5,90.65 D28.C | D22.C 61,82.2 | 61,82.2 D25.C | 61,82.2 63,82.2 v63.25,81.95 | D17.2 51.65,73.2 D16.C 51.9,71.45 v51.5,71.45 | D19.C 52.4,76.95 v51.5,76.95 51,77.45 D20.2 | 89,90.75 v89,90.95 | U11.2 52.5,74.7 v53,75.2 | U13.4 U13.5 72.25,80.1 R64.2 72.85,81.8 v73,81.95 | D2.2 10.15,45.45 D4.C 11,45.3 11,46.95 10.5,47.45 | 8.5,48.45 C1.2 8.5,49.45 9,49.95 D1.C | U1.2 10.5,47.45 | 10.5,47.45 11,47.95 11,49.6 D1.C | D3.2 9.7,52.45 10,52.75 11.3,52.75 11.5,52.55 11.5,50.8 D1.C | C4.2 8.5,35.45 9.25,36.2 D9.C 11,35.85 11,34.2 10.5,33.7 | U3.2 10.5,33.7
  Top 0.254: 10.5,33.7 11,33.2 11,31.55 D13.C 10,31.2 9.5,31.7 D12.2 | D8.2 7.85,38.7 7.35,38.2 7.35,35.25 v7.4,35.2 | D7.C 24.5,41.85 24.95,42.3 24.95,43.25 24.5,43.7 | 24.5,43.7 D6.2 | D10.C 20.1,32.6 20.6,33.1 20.6,39.35 20.95,39.7 U2.2 v28.2,39.7 | D11.2 26.5,29.95 27,29.45 v28.2,29.45 | 24.5,43.7 25,44.2 25,44.95 25.5,45.45 27,45.45 28,46.45 31.5,46.45 | D5.C 57.65,47.7 59.85,47.7 62.5,50.35 66.89,50.35 R2.1 | R3.1 80.5,48.55 v80.5,51.45
  Top 0.406: R43.1 7.85,65.6 7.75,65.7 | D41.C D42.C D43.C D44.C D45.C D46.C D47.C D48.C D49.C D50.C 61.9,3.35 63.5,4.95 | 68,28.95 C12.C | U5.2 64.92,25.88 65.05,26 65.8,26 67,27.2 69,27.2 69.62,27.83
  Top 0.44: J1.1 3.5,80.35 3.5,79.75 | 3.5,79.75 J1.3 | 3.5,79.75 3.5,79.15 | 3.5,79.15 J1.5 | 3.5,79.15 3.5,78.55 | 3.5,78.55 J1.7 | 3.5,78.55 3.5,77.95 | 3.5,77.95 J1.9 | 3.5,77.95 3.5,77.35 | 3.5,77.35 J1.11 | J1.13 3.5,76.75 | 3.5,76.75 3.5,77.35 | J1.15 3.5,76.15 | 3.5,76.15 3.5,76.75 | J1.17 3.5,75.55 | 3.5,75.55 3.5,76.15 | J1.19 3.5,74.95 3.5,75.55 | J1.41 3.5,64.75 3.5,64.15 | 3.5,64.15 J1.43 | J1.45 3.5,63.55 | 3.5,63.55 3.5,64.15 | J1.47 3.5,62.95 | 3.5,62.95 3.5,63.55 | J1.49 3.5,62.35 | 3.5,62.35 3.5,62.95 | J1.51 3.5,61.75 | 3.5,61.75 3.5,62.35 | J1.53 3.5,61.15 | 3.5,61.15 3.5,61.75 | J1.55 3.5,60.55 | 3.5,60.55 3.5,61.15 | J1.57 3.5,59.95 | 3.5,59.95 3.5,60.55 | J1.59 3.5,59.35 | 3.5,59.35 3.5,59.95 | J1.61 3.5,58.75 | 3.5,58.75 3.5,59.35 | J1.63 3.5,58.15 | 3.5,58.15 3.5,58.75 | J1.65 3.5,57.55 | 3.5,57.55 3.5,58.15 | J1.67 3.5,56.95 | 3.5,56.95 3.5,57.55 | J1.69 3.5,56.35 3.5,56.95 | J1.131 3.5,37.75 3.5,37.15 | 3.5,37.15 J1.133 | J1.135 3.5,36.55 | 3.5,36.55 3.5,37.15 | J1.137 3.5,35.95 | 3.5,35.95 3.5,36.55 | J1.139 3.5,35.35 3.5,35.95
  Top 0.45: U6.2 v83.67,26.16 v83.68,26.17
  Top 0.813: C36.2 v81.5,9.7 C42.C 81.5,4.7 81.5,2.7 70,2.7 65.5,2.7 63.5,4.7 63.5,4.95 C41.C v63.5,9.7 C35.2 | D15.C 90.5,31.2 91,31.7 | C16.C 88.72,26.17 v91,26.17 | C48.2 49,91.95 47.5,93.45 v47.5,94.7 | C47.2 42,91.95 v40.75,93.2 | v20,94.7 20,93.45 21.5,91.95 C44.2 | v33.75,94.7 33.75,93.45 35.25,91.95 C46.2 | v27,93.2 28.25,91.95 C45.2 | C43.2 v14.5,92.95 | C34.2 75.65,82.7 v75.5,82.7 | C31.2 43,77.45 | 43,77.45 43,76.95 | 43,76.95 C24.2 | JP3.1 42.85,76.8 43,76.95 | v45.3,77.35 43.1,77.35 43,77.45 | C3.2 v7.25,41.95 | C1.2 v7.35,48.95 | C4.2 v7.4,35.2 | C11.2 v7.35,28.2 | v4.8,36.55 4.15,36.55 | v28.2,29.45 29.25,29.45 C9.2 29.5,28.95 JP1.2 | C2.2 31.5,46.45 31.5,48.66 R111.1 30.5,49.66 30.5,54.7 21.05,64.15 v20.1,64.15 | D14.C 69.25,29.2 C12.C 69,28.45 69.62,27.83 v70,27.45 | 91,20.7 90.75,20.95 v89.5,20.95
  Top 1.27: 81.5,2.7 89,2.7 91,4.7 91,12.45 91,20.7 v91,26.17 91,31.7 v91,44.55
  Bottom 0.254: v51.5,71.45 53,71.45 | v80.5,51.45 91,51.45
  Bottom 0.44: J1.140 3.5,35.05 3.5,35.65 | 3.5,35.65 J1.138 | J1.136 3.5,36.25 | 3.5,36.25 3.5,35.65 | J1.134 3.5,36.85 | 3.5,36.85 3.5,36.25 | J1.132 3.5,37.45 | 3.5,37.45 3.5,36.85 | J1.130 3.5,38.05 | 3.5,38.05 3.5,37.45 | J1.128 3.5,38.65 | 3.5,38.65 3.5,38.05 | J1.126 3.5,39.25 | 3.5,39.25 3.5,38.65 | J1.124 3.5,39.85 | 3.5,39.85 3.5,39.25 | J1.122 3.5,40.45 | 3.5,40.45 3.5,39.85 | J1.120 3.5,41.05 | 3.5,41.05 3.5,40.45 | J1.118 3.5,41.65 | 3.5,41.65 3.5,41.05 | J1.116 3.5,42.25 | 3.5,42.25 3.5,41.65 | J1.114 3.5,42.85 | 3.5,42.85 3.5,42.25 | J1.112 3.5,43.45 | 3.5,43.45 3.5,42.85 | J1.110 3.5,44.05 | 3.5,44.05 3.5,43.45 | J1.108 3.5,44.65 | 3.5,44.65 3.5,44.05 | J1.106 3.5,45.25 | 3.5,45.25 3.5,44.65 | J1.104 3.5,45.85 | 3.5,45.85 3.5,45.25 | J1.102 3.5,46.45 | 3.5,46.45 3.5,45.85 | J1.100 3.5,47.05 | 3.5,47.05 3.5,46.45 | J1.98 3.5,47.65 | 3.5,47.65 3.5,47.05 | J1.96 3.5,48.25 | 3.5,48.25 3.5,47.65 | J1.94 3.5,48.85 | 3.5,48.85 3.5,48.25 | J1.92 3.5,49.45 | 3.5,49.45 3.5,48.85 | J1.90 3.5,50.05 | 3.5,50.05 3.5,49.45 | J1.88 3.5,50.65 | 3.5,50.65 3.5,50.05 | J1.86 3.5,51.25 | 3.5,51.25 3.5,50.65 | J1.84 3.5,51.85 | 3.5,51.85 3.5,51.25 | J1.82 3.5,52.45 3.5,51.85
  Bottom 0.45: v83.68,26.17 v91,26.17
  Bottom 0.813: J6.3 81.5,10.7 | 81.5,10.7 J6.4 | v81.5,9.7 81.5,10.7 | v63.5,9.7 63.5,10.7 | 63.5,10.7 J5.4 | J5.3 63.5,10.7 | v40.75,93.2 40.75,94.7 | 27,94.7 v27,93.2 | v14.5,92.95 14.5,93.7 15.5,94.7 v20,94.7 | v28.2,29.45 v28.2,39.7 28.2,46.44 R111.1 32.96,51.2 66.04,51.2 R2.1 | v70,27.45 70,26.2 75.25,20.95 v89.5,20.95
  Bottom 1.016: v20,94.7 27,94.7 v33.75,94.7 40.75,94.7 v47.5,94.7 v54.5,94.7 61.5,94.7 | 60,74.7 60.25,74.95 | v45.3,77.35 51.1,77.35 v51.5,76.95 53,75.45 v53,75.2 53,71.45 53,63.7
  Bottom 1.27: v91,44.55 91,51.45 91,62.45 | 16.75,12.2 16.75,16.35 7.35,25.75 v7.35,28.2 | 16.75,12.2 J3.4 18.05,9.4 | 18.05,9.4 27.45,9.4 J4.4 J4.3 | 16.75,12.2 J3.3 18.25,9.6 18.05,9.4
  other vias: 67.25,84.95 68.25,84.95 67.25,83.95 68.25,83.95 69.25,83.95 69.25,84.95 69.25,82.95 68.25,82.95 67.25,82.95 66.25,82.95 65.25,82.95 64.25,82.95 63.25,82.95 64.25,81.95 65.25,81.95 66.25,81.95 67.25,81.95 68.25,81.95 69.25,81.95 82.5,74.2 83.5,74.2 86.5,73.2 85.5,73.2 84.5,73.2 83.5,73.2 82.5,73.2 81.5,73.2 72,73.7 90,90.95 91,90.95 90,89.95 91,89.95 7.5,55.7 8.5,55.7 7.5,56.7 8.5,56.7 8.5,57.7 9.5,56.7 9.5,57.7 9.5,58.7 10.5,57.7 10.5,58.7 10.5,59.7 11.5,58.7 11.5,59.7
  pour Bottom (no thermals): 92,64.75 10.4,64.75 9.7,64.05 9.7,59.85 6.1,56.25 6.1,54.55 4.1,52.55 3.5,52.55 3.5,27.95 4.5,26.95 9.05,26.95 9.05,55.35 13.45,59.75 92,59.75
  pour Bottom (no thermals): 91,95.2 55.75,95.2 54.75,94.2 54.75,63.7 92,63.7 92,94.2
  pour Top (no thermals): 62.85,86.1 62.85,78.8 66.15,78.8 66.7,79.35 66.7,80.7 67.2,81.2 70,81.2 71,82.2 71,85.1 70,86.1
  pour Top (no thermals): 82.5,76.45 86.5,76.45 87.5,75.45 87.5,73.7 86.4,72.6 79.8,72.6 79.8,73.5 80.6,74.3 81.45,74.3 82,74.85 82,75.95
  pour Top (no thermals): 72.35,77 73.4,77 73.4,74.5 72.25,73.35 71.85,73.35 71.65,73.55 71.65,74.05 72.35,74.75
  pour Top (no thermals): 89.75,86.3 88.55,87.5 88.55,91.05 88.95,91.45 92,91.45 92,86.3
  pour Top (no thermals): 40.8,77.25 42,77.25 42.5,77.75 42.5,79.45 43.45,79.45 43.45,78.15 44.25,77.35 43.45,76.55 43.45,74.2 42.5,74.2 42.5,75.85 42,76.35 40.8,76.35
  pour Top (no thermals): 3.5,37.75 4.7,36.55 3.5,35.35
  pour Top (no thermals): 3.5,65.45 3.5,56.35 3.75,56.35 4.75,55.35 13.5,55.35 14,55.85 14,60.45 13.5,60.95 6,60.95 5.5,61.45 5.5,62.45 5.7,62.65 6.35,62.65 6.35,64.7 6.85,65.2 8.25,65.2 8.25,67.7 8.75,68.2 17,68.2 17.5,68.7 17.5,75.45 13.9,79.05 4.8,79.05 3.5,80.35 3.5,74.95 6,74.95 6.75,74.2 6.75,73.7 5,71.95 4.45,70 4.45,66.45
PMIC_BOOT0
  Top 0.254: U16.60 21.3,12.95 18.55,10.2 JP4.2
PMIC_I2C_SCL  (via drill 0.35)